# Altium schematic sheet Remote_ASK_PCB.SchDoc
size 381 x 241 mm
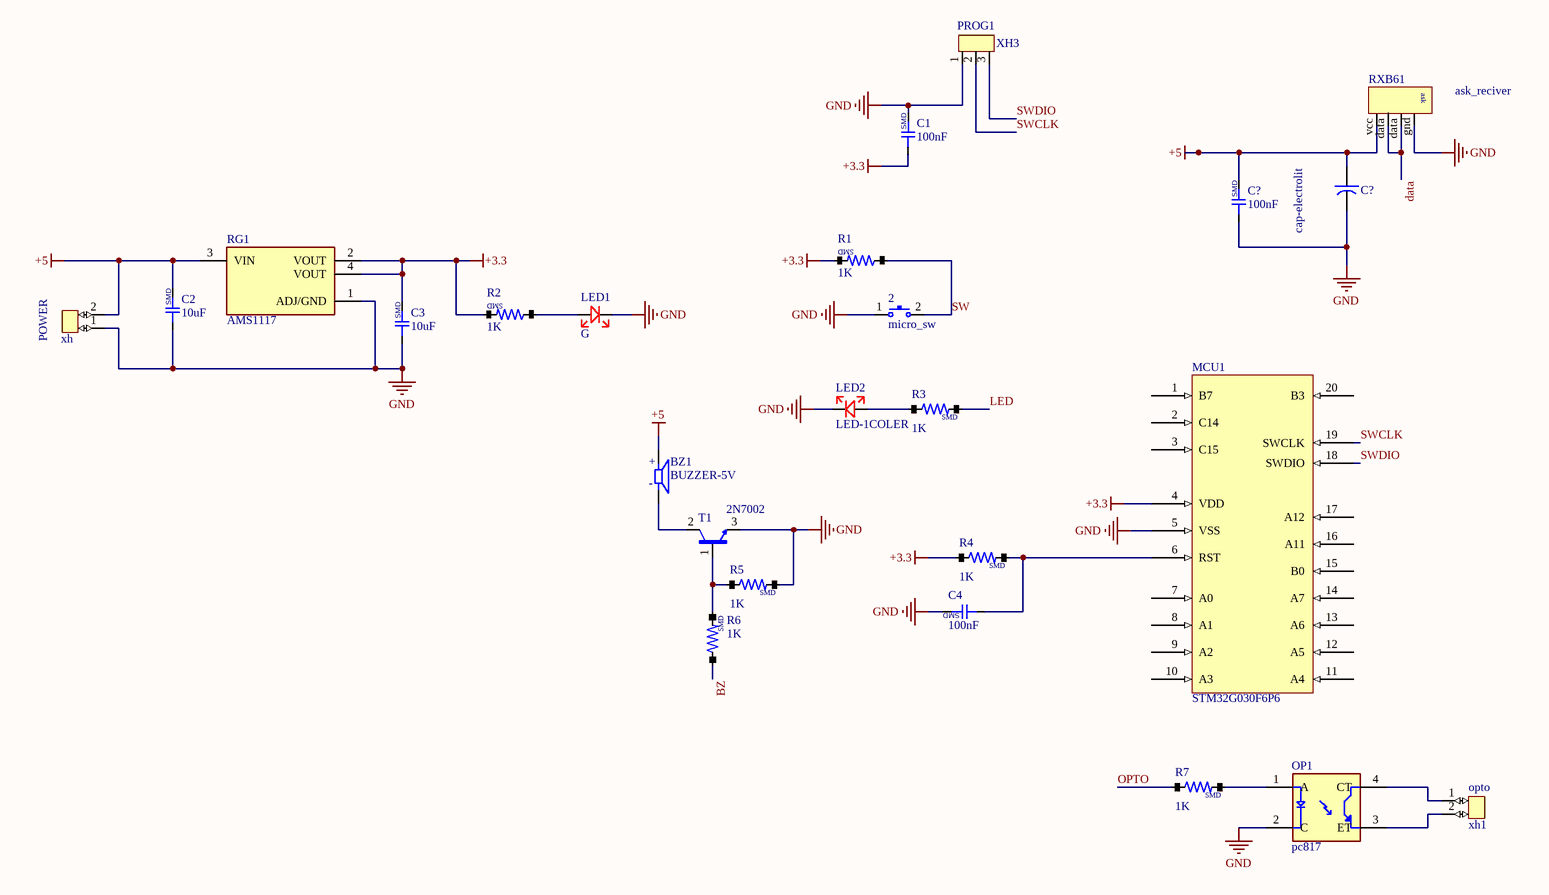
[diagram p0: Remote_ASK_PCB.SchDoc]

## Parts
(Parts that share a designator on the sheet are numbered #1, #2 ... from top to bottom, then left to right.)
2  micro_sw  [micro_sw]
BZ1  BUZZER-5V  [BUZZER-5V]
C1  100nF  [CAP-0603]
C2  10uF  [CAP-0805]
C3  10uF  [CAP-0805]
C4  100nF  [CAP-0603]
C?#1  cap-electrolit  [Tantalum Case B]
C?#2  100nF  [CAP-0603]
LED1  G  [LED/0805]
LED2  LED-1COLER  [led/3MM/DIP]
MCU1  STM32G030F6P6  [stm32G030F6P6]
OP1  pc817  [pc817]
opto  xh1  [CONECTOR/XH/2PIN]
POWER  xh  [CONECTOR/XH/2PIN]
PROG1  XH3  [XH3]
R1  1K  [RES/0603]
R2  1K  [RES/0603]
R3  1K  [RES/0603]
R4  1K  [RES/0603]
R5  1K  [RES/0603]
R6  1K  [RES/0603]
R7  1K  [RES/0603]
RG1  AMS1117  [AMS1117]
RXB61  ask_reciver  [ask_reciver]
T1  2N7002  [SOT23]

## Nets
+3.3: C1.1 C3.2 MCU1.4(VDD) R1.2 R2.2 R4.1 RG1.2(VOUT) RG1.4(VOUT)
+5: BZ1.P C2.2 C?#1.+ C?#2.2 POWER.2 RG1.3(VIN) RXB61.vcc
GND: 2.1 C1.2 C2.1 C3.1 C4.2 C?#1.- C?#2.1 LED1.K LED2.K MCU1.5(VSS) OP1.2(C) POWER.1 PROG1.1 R5.2 RG1.1(ADJ/GND) RXB61.gnd T1.3(E)
BZ: R6.1
data: RXB61.data
LED: R3.2
OPTO: R7.1
SW: 2.2 R1.1
SWCLK: MCU1.19(SWCLK) PROG1.2
SWDIO: MCU1.18(SWDIO) PROG1.3
NetBZ1_N: BZ1.N T1.2(C)
NetC4_1: C4.1 MCU1.6(RST) R4.2
NetLED1_A: LED1.A R2.1
NetLED2_A: LED2.A R3.1
NetOP1_1: OP1.1(A) R7.2
NetOP1_3: OP1.3(ET) opto.2
NetOP1_4: OP1.4(CT) opto.1
NetR5_1: R5.1 R6.2 T1.1(B)

Not connected (* = marked no-connect by the designer): MCU1 1(B7) 2(C14) 3(C15) 7(A0) 8(A1) 9(A2) 10(A3) 11(A4) 12(A5) 13(A6) 14(A7) 15(B0) 16(A11) 17(A12) 20(B3)

## Notes on the sheet
- (in symbol ask_reciver) ask
- (in symbol BUZZER-5V) +; -
- (in symbol cap_smd) SMD
- (in symbol RES/SMD) SMD

## Library data of the parts
C1-C4 C?#2 = cap_smd
LED1 = LED-1COLER
opto POWER = CONECTOR/XH/2PIN
R1-R7 = RES/SMD
T1 = NPN